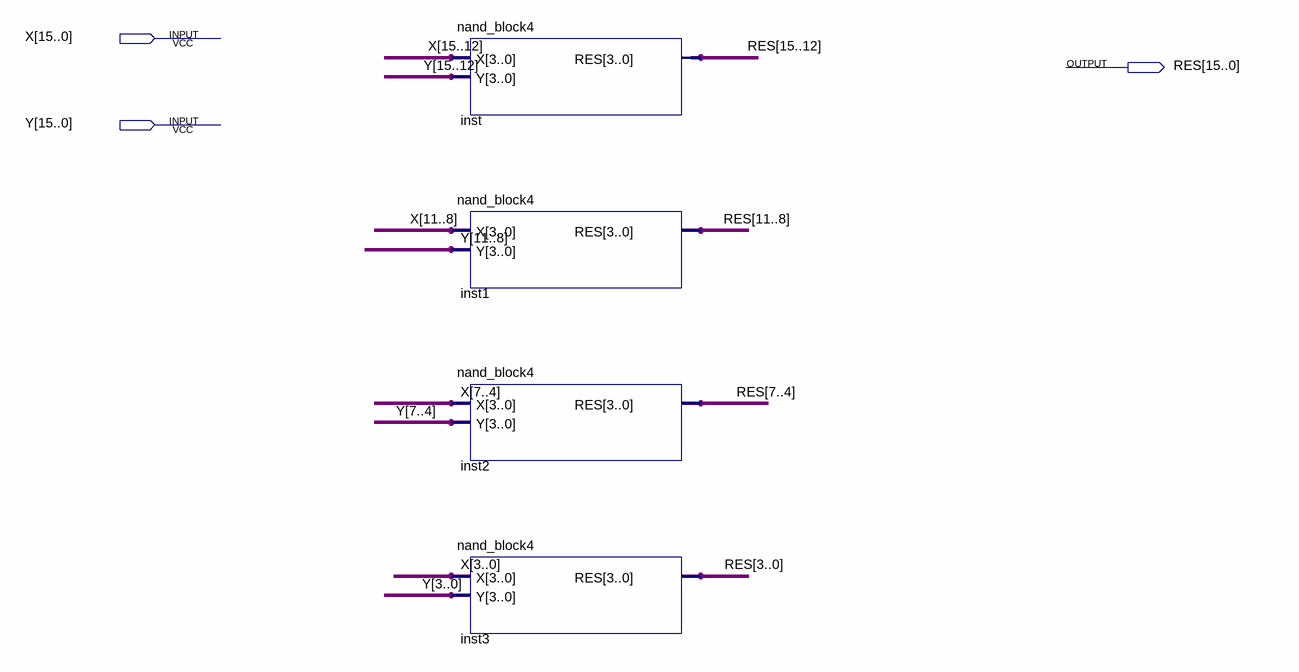
[diagram p0: schematic sheet]
// Quartus schematic nand_block16.bdf as structural Verilog: 4 symbols, 3 pins
module nand_block16 (
  input  [15:0] X,
  input  [15:0] Y,
  output [15:0] RES
);

  nand_block4 inst (.X(X[15:12]), .Y(Y[15:12]), .RES(RES[15:12]));
  nand_block4 inst1 (.X(X[11:8]), .Y(Y[11:8]), .RES(RES[11:8]));
  nand_block4 inst2 (.X(X[7:4]), .Y(Y[7:4]), .RES(RES[7:4]));
  nand_block4 inst3 (.X(X[3:0]), .Y(Y[3:0]), .RES(RES[3:0]));
endmodule
